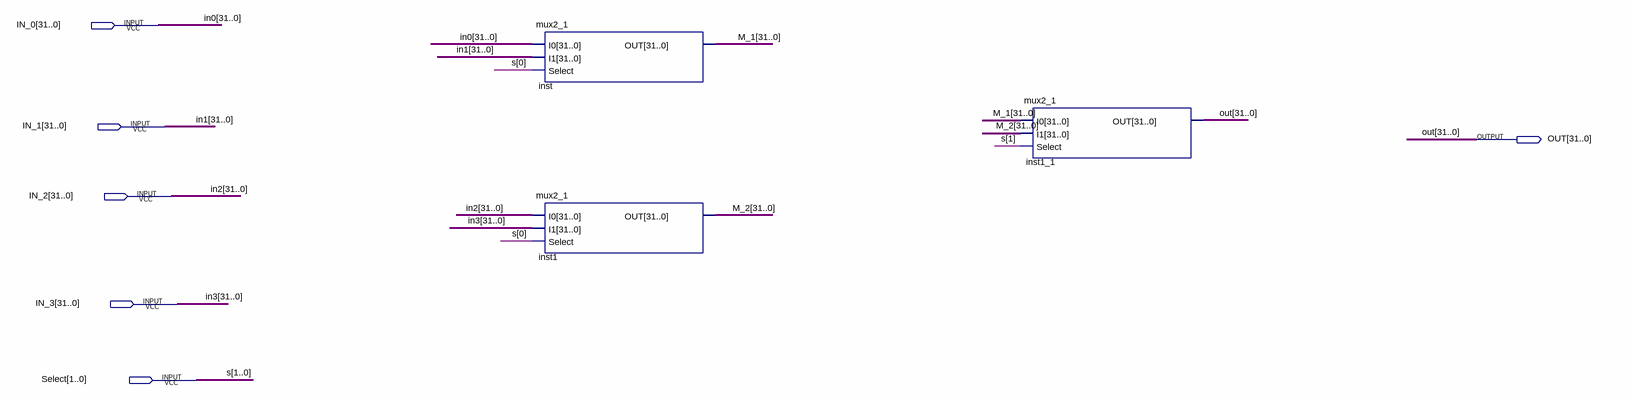
[diagram p0: schematic sheet]
// Quartus schematic mux4_1.bdf as structural Verilog: 3 symbols, 6 pins
module mux4_1 (
  input  [31:0] IN_0,
  input  [31:0] IN_1,
  input  [31:0] IN_2,
  input  [31:0] IN_3,
  input  [1:0] Select,
  output [31:0] OUT
);

  wire [31:0] M_1, M_2;

  mux2_1 inst (.I0(IN_0), .I1(IN_1), .Select(Select[0]), .OUT(M_1));
  mux2_1 inst1 (.I0(IN_2), .I1(IN_3), .Select(Select[0]), .OUT(M_2));
  mux2_1 inst1_1 (.I0(M_1), .I1(M_2), .Select(Select[1]), .OUT(OUT));

  // Other names for the same wires on the sheet: in0[31:0] = IN_0; in1[31:0] = IN_1; in2[31:0] = IN_2;
  //   in3[31:0] = IN_3; s[1:0] = Select
endmodule
